# Altium project STM32F103C8.PrjPcb
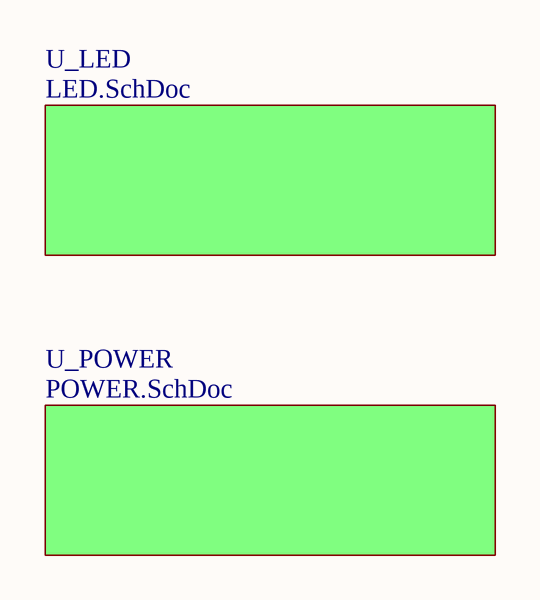
[diagram p0: MAIN.SchDoc]
3 sheets, 43 parts. Net scope: global (net labels, ports and power ports of the same name join across sheets).
Board file: TimeDemo.PcbDoc
Sheets:
  MAIN.SchDoc
    U_LED = LED.SchDoc
    U_POWER = POWER.SchDoc

## Sheet MAIN.SchDoc
size A4

### Sub-sheets
U_LED = LED.SchDoc: no entries
U_POWER = POWER.SchDoc: no entries

## Sheet LED.SchDoc
size A4; DocumentNumber: 1
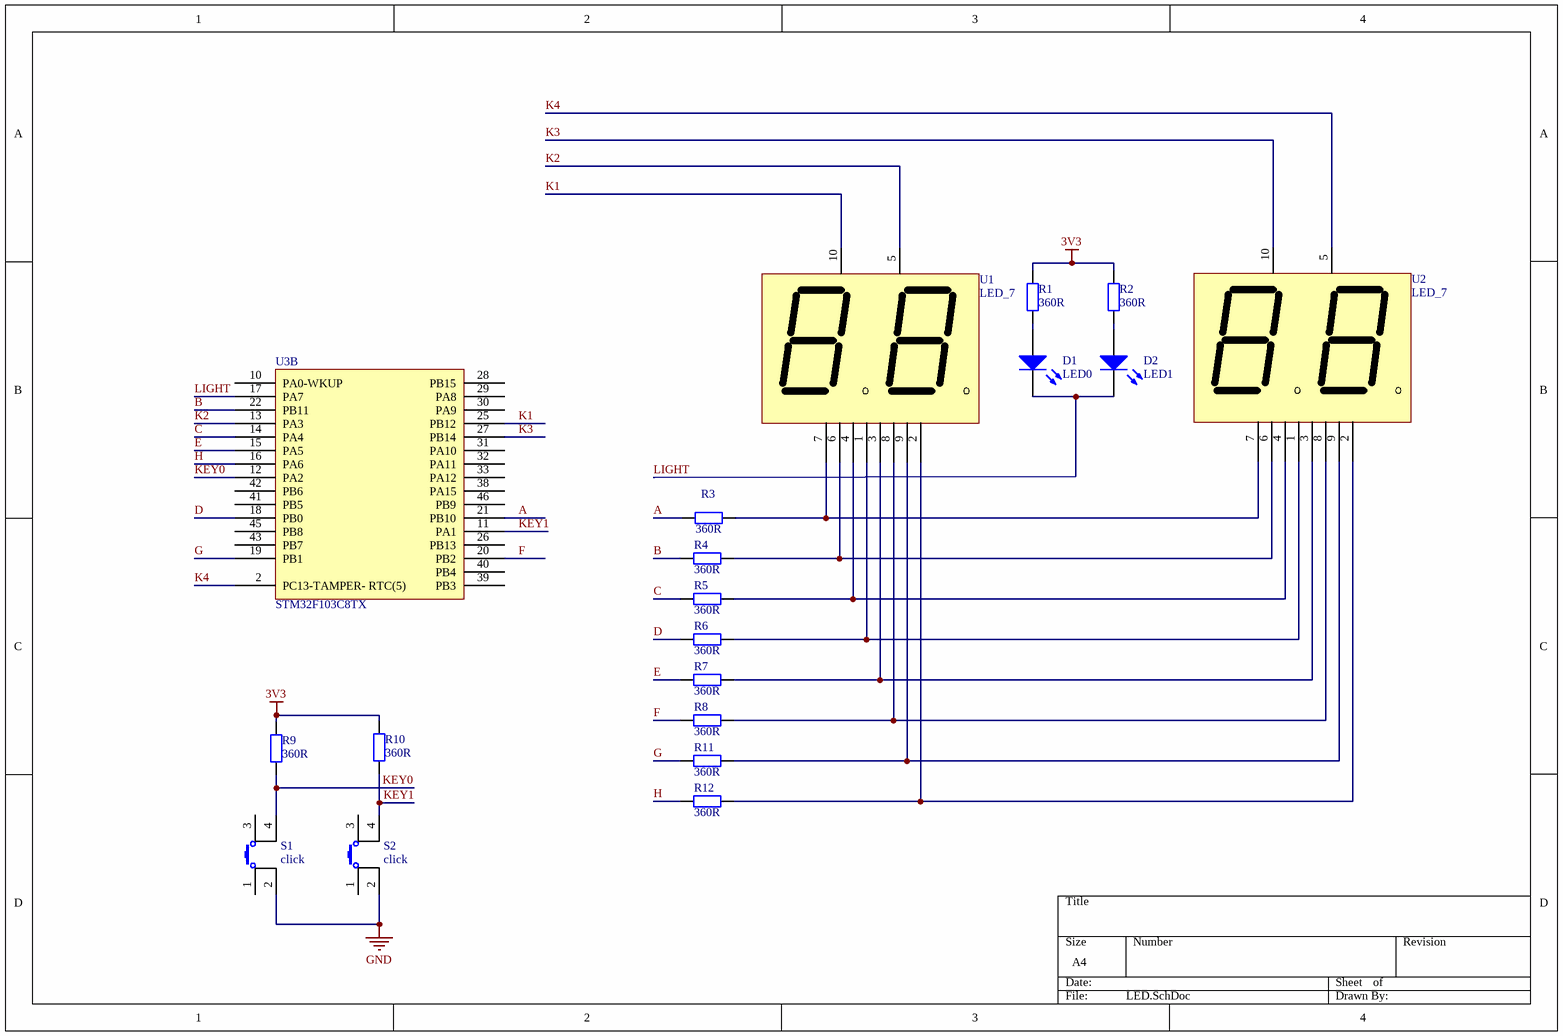
[diagram p1: LED.SchDoc]

### Parts
D1  LED0  [LED3MM-RED]
D2  LED1  [LED3MM-RED]
R1  360R  [R0603]
R2  360R  [R0603]
R3  360R  [R0603]
R4  360R  [R0603]
R5  360R  [R0603]
R6  360R  [R0603]
R7  360R  [R0603]
R8  360R  [R0603]
R9  360R  [R0603]
R10  360R  [R0603]
R11  360R  [R0603]
R12  360R  [R0603]
S1  click  [TSW SMD-6*6*5]
S2  click  [TSW SMD-6*6*5]
U1  LED_7  [SMG 0.56-2P]
U2  LED_7  [SMG 0.56-2P]
U3  STM32F103C8TX  [PQFP48]  (part B of 2)

### Nets
3V3: R1.2 R2.2 R9.2 R10.2
GND: S1.2 S2.2
A: R3.1 U3.21(PB10)
B: R4.1 U3.22(PB11)
C: R5.1 U3.14(PA4)
D: R6.1 U3.18(PB0)
E: R7.1 U3.15(PA5)
F: R8.1 U3.20(PB2)
G: R11.1 U3.19(PB1)
H: R12.1 U3.16(PA6)
K1: U1.10(COM) U3.25(PB12)
K2: U1.5(COM) U3.13(PA3)
K3: U2.10(COM) U3.27(PB14)
K4: U2.5(COM) U3.2(PC13-TAMPER-_RTC(5))
KEY0: R9.1 S1.4 U3.12(PA2)
KEY1: R10.1 S2.4 U3.11(PA1)
LIGHT: D1.2(K) D2.2(K) U3.17(PA7)
NetD1_1: D1.1(A) R1.1
NetD2_1: D2.1(A) R2.1
NetR3_2: R3.2 U1.7(A) U2.7(A)
NetR4_2: R4.2 U1.6(B) U2.6(B)
NetR5_2: R5.2 U1.4(C) U2.4(C)
NetR6_2: R6.2 U1.1(D) U2.1(D)
NetR7_2: R7.2 U1.3(E) U2.3(E)
NetR8_2: R8.2 U1.8(F) U2.8(F)
NetR11_2: R11.2 U1.9(G) U2.9(G)
NetR12_2: R12.2 U1.2(P) U2.2(P)

Not connected (* = marked no-connect by the designer): S1 1 3; S2 1 3; U3 10(PA0-WKUP) 26(PB13) 28(PB15) 29(PA8) 30(PA9) 31(PA10) 32(PA11) 33(PA12) 38(PA15) 39(PB3) 40(PB4) 41(PB5) 42(PB6) 43(PB7) 45(PB8) 46(PB9)

### Library data of the parts
D1 D2 = LED0: Typical INFRARED GaAs LED; Published: 8-Jun-2000; LatestRevisionDate: 08-Jul-2005; LatestRevisionNote: Mech Layer 1 removed.; PackageReference: LED-0; Publisher: Altium Limited; PackageDescription: LED; 2 Leads
R1-R12 = Res2: Resistor; Value: 1K; Published: 8-Jun-2000; LatestRevisionDate: 17-Jul-2002; LatestRevisionNote: Re-released for DXP Platform.; PackageReference: AXIAL-0.4; Publisher: Altium Limited; PackageDescription: Axial Device, Thru-Hole; 2 Leads; 0.4 in Pin Spacing
U3 = Component_1

## Sheet POWER.SchDoc
size A4
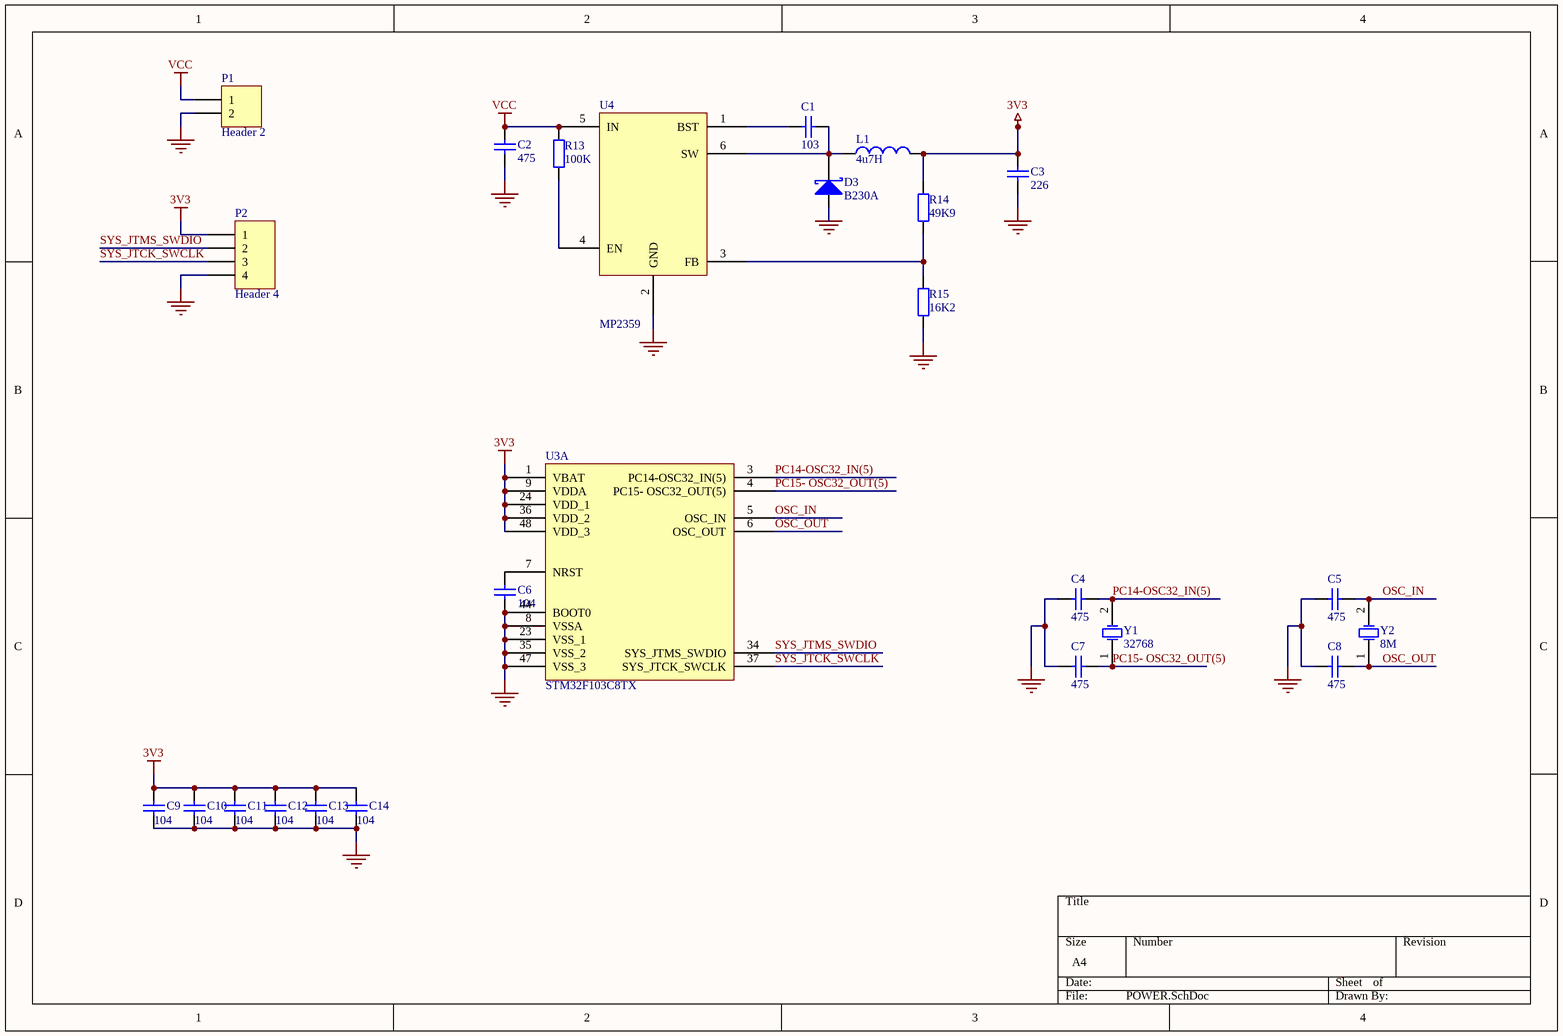
[diagram p2: POWER.SchDoc]

### Parts
C1  103  [C0603]
C2  475  [C1206]
C3  226  [C0805]
C4  475  [C0603]
C5  475  [C0603]
C6  104  [C0603]
C7  475  [C0603]
C8  475  [C0603]
C9  104  [C0603]
C10  104  [C0603]
C11  104  [C0603]
C12  104  [C0603]
C13  104  [C0603]
C14  104  [C0603]
D3  B230A  [SMA]
L1  4u7H  [L4X4]
P1  Header 2  [XH2P54P2]
P2  Header 4  [SIP4]
R13  100K  [R0603]
R14  49K9  [R0603]
R15  16K2  [R0603]
U3  STM32F103C8TX  [PQFP48]  (part A of 2)
U4  MP2359  [SOT23-6]
Y1  32768  [FC-135]
Y2  8M  [CY5032]

### Nets
3V3: C3.2 C9.2 C10.2 C11.2 C12.2 C13.2 C14.2 L1.2 P2.1 R14.2 U3.1(VBAT) U3.9(VDDA) U3.24(VDD_1) U3.36(VDD_2) U3.48(VDD_3)
GND: C2.1 C3.1 C4.2 C5.2 C6.1 C7.2 C8.2 C9.1 C10.1 C11.1 C12.1 C13.1 C14.1 D3.1(A) P1.2 P2.4 R15.1 U3.8(VSSA) U3.23(VSS_1) U3.35(VSS_2) U3.44(BOOT0) U3.47(VSS_3) U4.2(GND)
VCC: C2.2 P1.1 R13.2 U4.5(IN)
OSC_IN: C5.1 U3.5(OSC_IN) Y2.2(OSC2)
OSC_OUT: C8.1 U3.6(OSC_OUT) Y2.1(OSC1)
PC14-OSC32_IN(5): C4.1 U3.3(PC14-OSC32_IN(5)) Y1.2(OSC2)
PC15- OSC32_OUT(5): C7.1 U3.4(PC15-_OSC32_OUT(5)) Y1.1(OSC1)
SYS_JTCK_SWCLK: P2.3 U3.37(SYS_JTCK_SWCLK)
SYS_JTMS_SWDIO: P2.2 U3.34(SYS_JTMS_SWDIO)
NetC1_1: C1.1 U4.1(BST)
NetC1_2: C1.2 D3.2(K) L1.1 U4.6(SW)
NetC6_2: C6.2 U3.7(NRST)
NetR13_1: R13.1 U4.4(EN)
NetR14_1: R14.1 R15.2 U4.3(FB)

### Library data of the parts
C1 C4-C14 = Cap: Capacitor; Published: 8-Jun-2000; LatestRevisionDate: 17-Jul-2002; LatestRevisionNote: Re-released for DXP Platform.; PackageReference: RAD-0.3; Publisher: Altium Limited; PackageDescription: Radial Cap, Thru-Hole; 2 Leads; 0.3 in Pin Spacing
  C1: Value: 103
  C4 C5 C7 C8: Value: 475
  C6 C9 C11-C14: Value: 104
C2 C3 = Cap: Capacitor; Value: 100pF; Published: 8-Jun-2000; LatestRevisionDate: 17-Jul-2002; LatestRevisionNote: Re-released for DXP Platform.; PackageReference: RAD-0.3; Publisher: Altium Limited; PackageDescription: Radial Cap, Thru-Hole; 2 Leads; 0.3 in Pin Spacing
D3 = D Schottky: Schottky Diode; Published: 8-Jun-2000; LatestRevisionDate: 17-Jul-2002; LatestRevisionNote: Re-released for DXP Platform.; PackageReference: SMB; Publisher: Altium Limited; PackageDescription: DO-214-AA/SMB; 2 C-Bend Leads; Body 5.3 x 3.6 mm, inc. leads (LxW); Code_JEDEC: DO-214-AA
L1 = Inductor: Code_IEC: 1005; Published: 8-Jun-2000; LatestRevisionDate: 29-May-2009; LatestRevisionNote: IPC-7351 Footprint Added.; PackageReference: 0402-A; Publisher: Altium Limited; PackageDescription: Chip Inductor; Code_JEITA: 0402; Value: 4u7H
P1 = Header 2: Header, 2-Pin; LatestRevisionDate: 17-Jul-2002; LatestRevisionNote: Re-released for DXP Platform.; Publisher: Altium Limited
P2 = Header 4: Header, 4-Pin; LatestRevisionDate: 17-Jul-2002; LatestRevisionNote: Re-released for DXP Platform.; Publisher: Altium Limited
R13 = Res2: Resistor; Published: 8-Jun-2000; LatestRevisionDate: 17-Jul-2002; LatestRevisionNote: Re-released for DXP Platform.; PackageReference: AXIAL-0.4; Publisher: Altium Limited; PackageDescription: Axial Device, Thru-Hole; 2 Leads; 0.4 in Pin Spacing
R14 R15 = Res2: Resistor; Value: 1K; Published: 8-Jun-2000; LatestRevisionDate: 17-Jul-2002; LatestRevisionNote: Re-released for DXP Platform.; PackageReference: AXIAL-0.4; Publisher: Altium Limited; PackageDescription: Axial Device, Thru-Hole; 2 Leads; 0.4 in Pin Spacing
U3 = Component_1
Y1 Y2 = XTAL: Crystal Oscillator; Published: 8-Jun-2000; LatestRevisionDate: 17-Jul-2002; LatestRevisionNote: Re-released for DXP Platform.; PackageReference: R38; Publisher: Altium Limited; PackageDescription: Crystal, Thru-Hole; 2 Leads; Body 3.1 x 8.2 mm (Dia.xH)

## Nets that join several sheets
3V3: LED (R1.2 R2.2 R9.2 R10.2), POWER (15 pins)
GND: LED (S1.2 S2.2), POWER (23 pins)